# Altium schematic sheet 1_cover.SchDoc: Cover and Block Diagram
size A4; ENG_APP_DATE: --/--/--; DSN_APP_DATE: --/--/--; CHK_APP_DATE: --/--/--; OrganizationName: Pluton UPV; Address1: Universitat Politècnica; Address2: de València (UPV); Address3: Camí de Vera, València; Address4: Spain; SheetNumber: 1; SheetTotal: 6
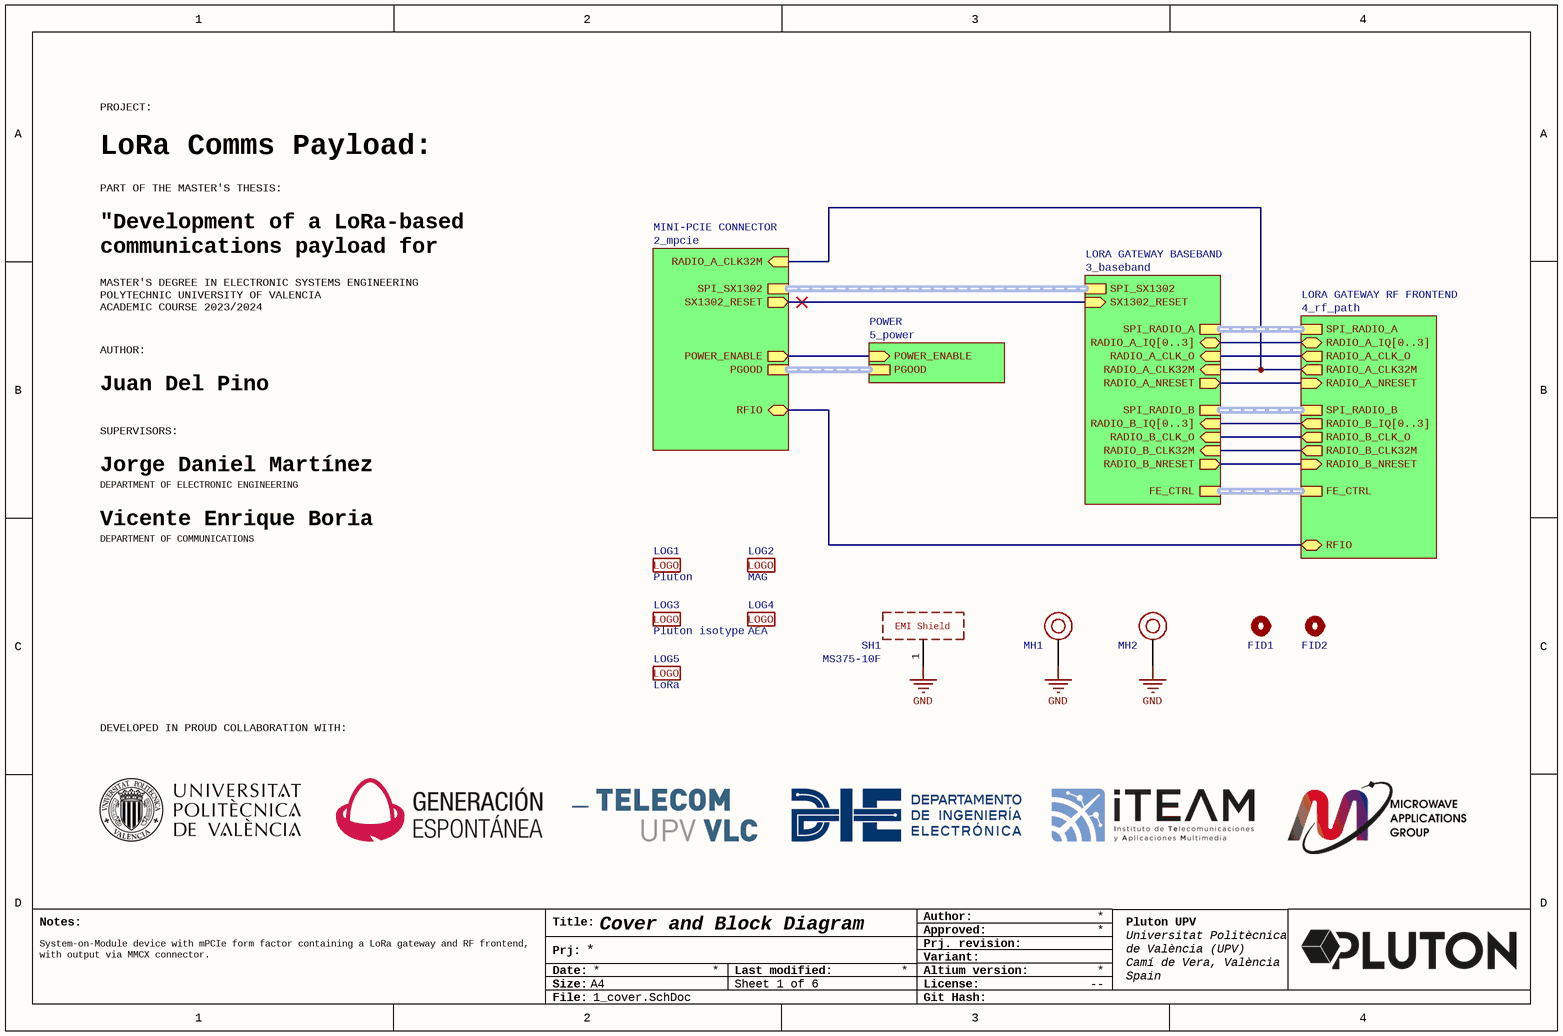
[diagram p0: 1_cover.SchDoc]

## Parts
FID1  Fiducial Mark  [Fiducial_1_3_mm]  (value not drawn)  (no BOM)
FID2  Fiducial Mark  [Fiducial_1_3_mm]  (value not drawn)  (no BOM)
LOG1  Pluton  [logo_pluton_small]  (no BOM)
LOG2  MAG  [logo_mag]  (no BOM)
LOG3  Pluton isotype  [logo_pluton_isotype_small]  (no BOM)
LOG4  AEA  [logo_aea]  (no BOM)
LOG5  LoRa  [logo_lora]  (no BOM)
MH1  M2.5  [MH mPCIe M2.5]  (value not drawn)  (no BOM)
MH2  M2.5  [MH mPCIe M2.5]  (value not drawn)  (no BOM)
SH1  MS375-10F  [MS375-10F]

## Sub-sheets
LORA GATEWAY BASEBAND = 3_baseband: RADIO_A_CLK_O (in), RADIO_A_IQ[0..3] (bidir), RADIO_B_CLK_O (in), RADIO_B_IQ[0..3] (in), RADIO_B_NRESET (out), RADIO_A_NRESET (out), RADIO_A_CLK32M (in), RADIO_B_CLK32M (in), SX1302_RESET (in), SPI_RADIO_A (harness SPI_RADIO_A), SPI_RADIO_B (harness SPI_RADIO_B), SPI_SX1302 (harness SPI_SX1302), FE_CTRL (harness FE_CTRL)
LORA GATEWAY RF FRONTEND = 4_rf_path: RADIO_A_CLK_O (out), RADIO_A_NRESET (in), RADIO_B_NRESET (in), RADIO_B_CLK32M (out), RADIO_A_CLK32M (out), RADIO_B_IQ[0..3] (out), RADIO_B_CLK_O (out), RADIO_A_IQ[0..3] (bidir), SPI_RADIO_B (harness SPI_RADIO_B), SPI_RADIO_A (harness SPI_RADIO_A), FE_CTRL (harness FE_CTRL), RFIO (bidir)
MINI-PCIE CONNECTOR = 2_mpcie: POWER_ENABLE (out), SPI_SX1302 (harness SPI_SX1302), SX1302_RESET (out), PGOOD (harness PGOOD), RADIO_A_CLK32M (in), RFIO (bidir)
POWER = 5_power: POWER_ENABLE (in), PGOOD (harness PGOOD)

## Nets
GND: MH1.1 MH2.1 SH1.1
(unnamed): sheet MINI-PCIE CONNECTOR/POWER_ENABLE, sheet POWER/POWER_ENABLE
(unnamed): sheet MINI-PCIE CONNECTOR/SX1302_RESET, sheet LORA GATEWAY BASEBAND/SX1302_RESET
(unnamed): sheet MINI-PCIE CONNECTOR/RADIO_A_CLK32M, sheet LORA GATEWAY BASEBAND/RADIO_A_CLK32M, sheet LORA GATEWAY RF FRONTEND/RADIO_A_CLK32M
(unnamed): sheet MINI-PCIE CONNECTOR/RFIO, sheet LORA GATEWAY RF FRONTEND/RFIO
(unnamed): sheet LORA GATEWAY BASEBAND/RADIO_A_CLK_O, sheet LORA GATEWAY RF FRONTEND/RADIO_A_CLK_O
(unnamed): sheet LORA GATEWAY BASEBAND/RADIO_B_CLK_O, sheet LORA GATEWAY RF FRONTEND/RADIO_B_CLK_O
(unnamed): sheet LORA GATEWAY BASEBAND/RADIO_B_NRESET, sheet LORA GATEWAY RF FRONTEND/RADIO_B_NRESET
(unnamed): sheet LORA GATEWAY BASEBAND/RADIO_A_NRESET, sheet LORA GATEWAY RF FRONTEND/RADIO_A_NRESET
(unnamed): sheet LORA GATEWAY BASEBAND/RADIO_B_CLK32M, sheet LORA GATEWAY RF FRONTEND/RADIO_B_CLK32M

## Buses and harness runs
bus sheet LORA GATEWAY BASEBAND/RADIO_A_IQ[0..3] = sheet LORA GATEWAY RF FRONTEND/RADIO_A_IQ[0..3]
bus sheet LORA GATEWAY BASEBAND/RADIO_B_IQ[0..3] = sheet LORA GATEWAY RF FRONTEND/RADIO_B_IQ[0..3]
harness sheet LORA GATEWAY BASEBAND/FE_CTRL = sheet LORA GATEWAY RF FRONTEND/FE_CTRL
harness sheet LORA GATEWAY BASEBAND/SPI_RADIO_A = sheet LORA GATEWAY RF FRONTEND/SPI_RADIO_A
harness sheet LORA GATEWAY BASEBAND/SPI_RADIO_B = sheet LORA GATEWAY RF FRONTEND/SPI_RADIO_B
harness sheet LORA GATEWAY BASEBAND/SPI_SX1302 = sheet MINI-PCIE CONNECTOR/SPI_SX1302
harness sheet MINI-PCIE CONNECTOR/PGOOD = sheet POWER/PGOOD

## Notes on the sheet
- PROJECT:
- LoRa Comms Payload: System-on-Module
- PART OF THE MASTER'S THESIS:
- MASTER'S DEGREE IN ELECTRONIC SYSTEMS ENGINEERING
  POLYTECHNIC UNIVERSITY OF VALENCIA
  ACADEMIC COURSE 2023/2024
- "Development of a LoRa-based communications payload for CubeSat"
- AUTHOR:
- Juan Del Pino Mena
- SUPERVISORS:
- Jorge Daniel Martínez Pérez
- Vicente Boria Esbert
- DEPARTMENT OF ELECTRONIC ENGINEERING
- Vicente Enrique Boria Esbert
- DEPARTMENT OF COMMUNICATIONS
- DEVELOPED IN PROUD COLLABORATION WITH:
- System-on-Module device with mPCIe form factor containing a LoRa gateway and RF frontend, with output via MMCX connector.
- Notes:
- Title:
- Author:
- Approved:
- Date:
- Prj:
- Size:
- A4
- Last modified:
- Altium version:
- Variant:
- Prj. revision:
- License:
- --
- File:
- Git Hash:
- (in symbol Logo) LOGO
- (in symbol Masach shield MS375-10F) EMI Shield

## Library data of the parts
FID1 FID2 = Fiducial Mark: FIducial Mark (concentric 1 mm, 3 mm)
LOG1-LOG5 = Logo
MH1 MH2 = MH M2.5 Mounting hole: Mounting Hole M2.5 for mPCIe
SH1 = Masach shield MS375-10F